# EasyEDA schematic brashmi.json
TITLE: B.R.A.S - HMI & Arduino Mega; REV: 1.1; Date: 13/03/2024; Sheet: 1/1; Company: Lucas kerogs
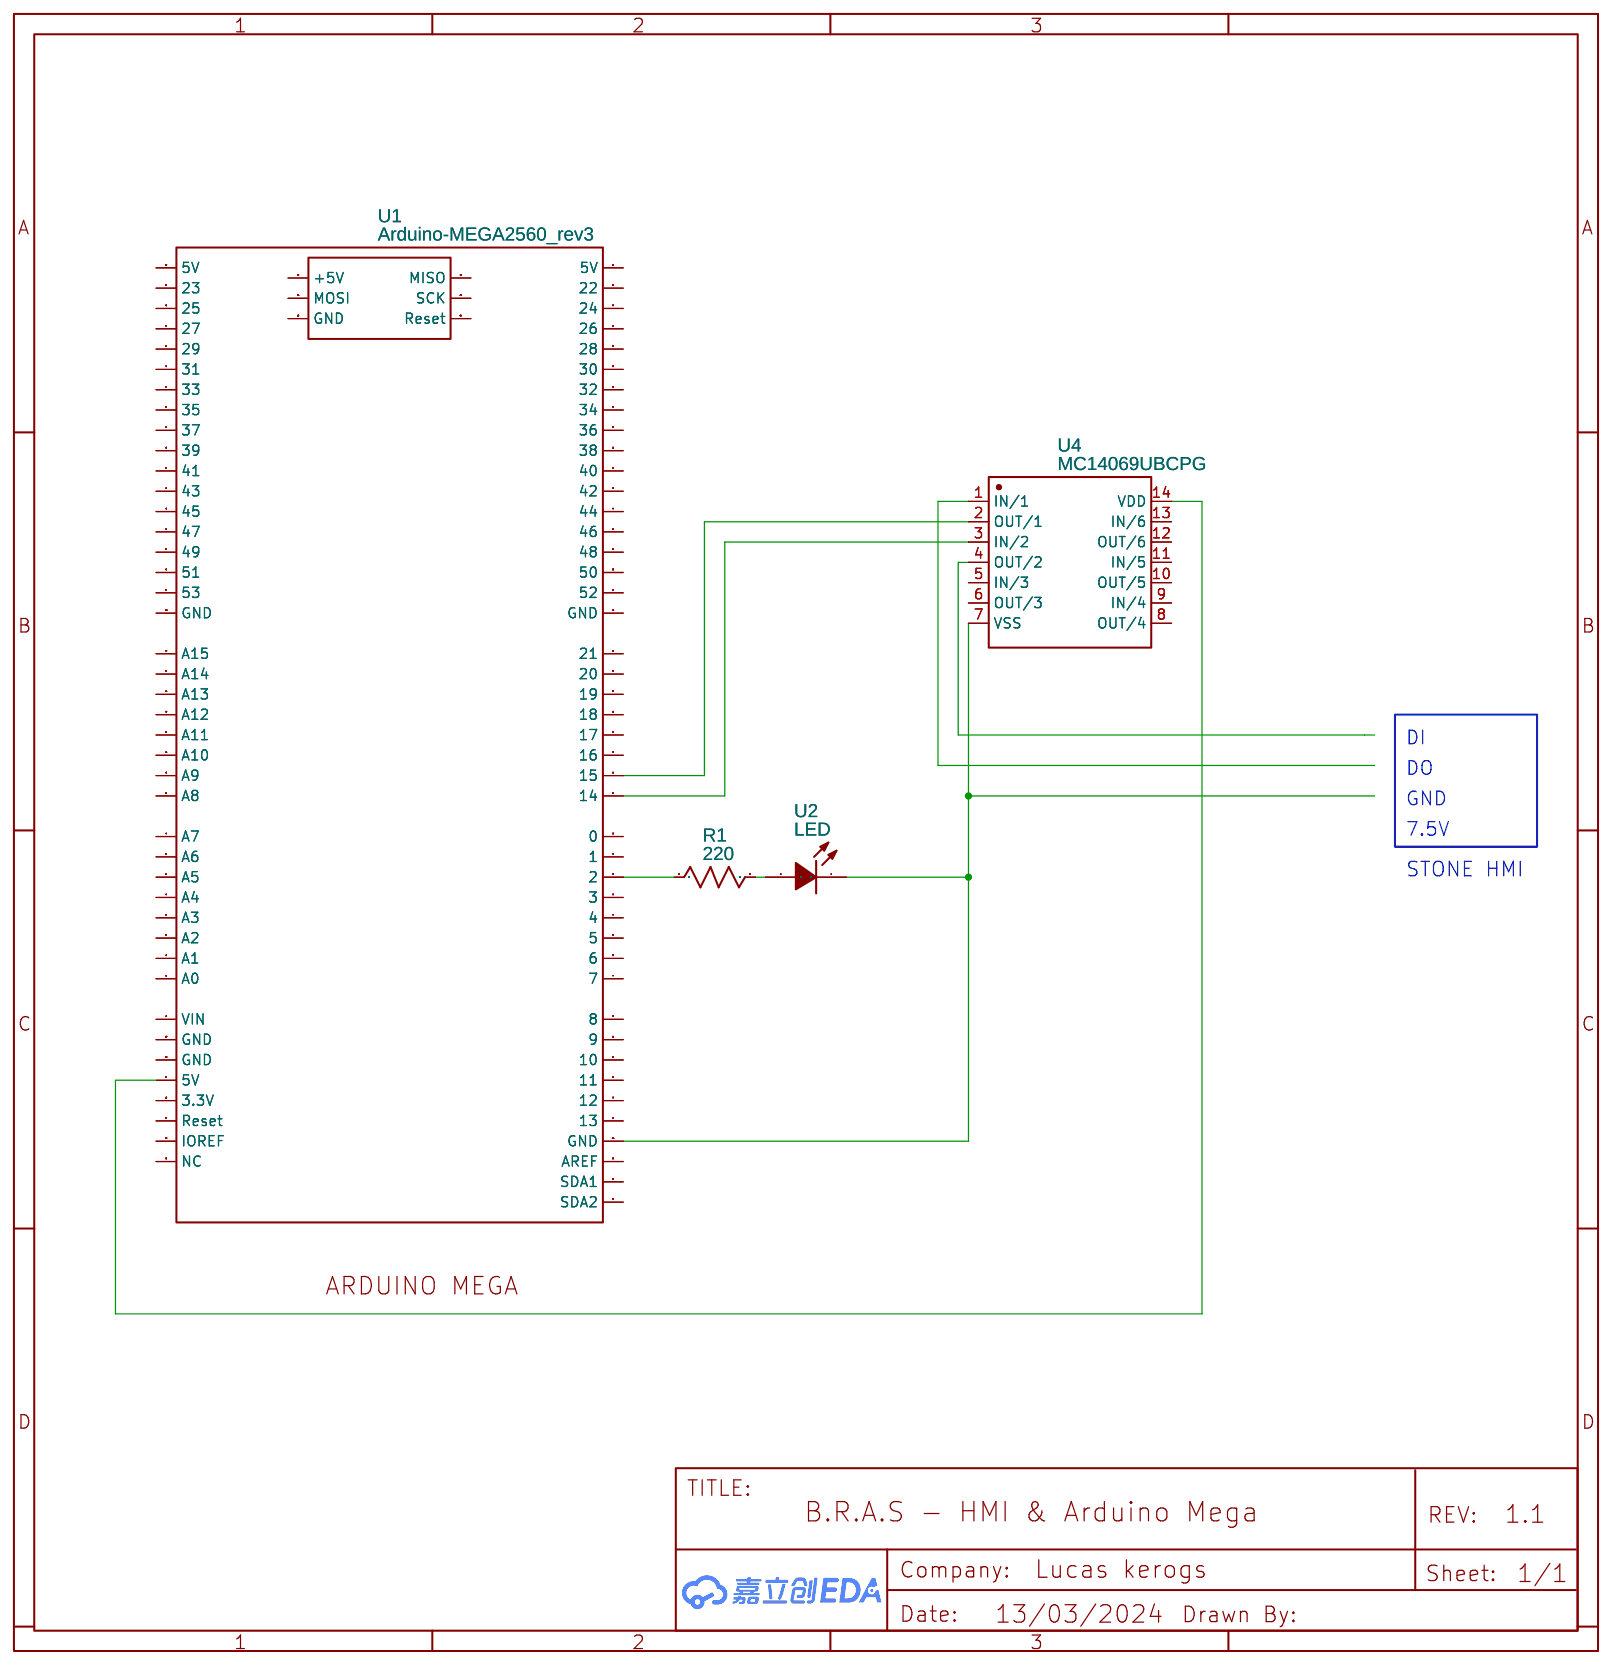
[diagram p0: schematic sheet]

## Parts
R1  220  [R0603]
U1  Arduino-MEGA2560_rev3  [ARDUINO-MEGA2560_REV3-SLOT-FOOTPRINT]
U2  LED  [LED-SMD_SD65-120-LED]
U4  MC14069UBCPG  [DIP14]

## Library data of the parts
R1 = R_0603_US: Contributor: LCEDA_Lib
U1 = Arduino-MEGA2560_rev3: Contributor: macjhon
U2 = 720-LCGH9RNMXNX1: Contributor: lcsc; Supplier: LCSC; Supplier Part: C9900019959; Manufacturer: null; JLCPCB Part Class: Extended Part
U4 = MC14069UBCPG

## Nets
Net-(R1-1): R1.1 U1.2
Net-(R1-2): R1.2 U2.2(A)
Net-(U1-5V): U1.5V U4.14(VDD)
Net-(U1-14): U1.14 U4.3(IN/2)
Net-(U1-15): U1.15 U4.2(OUT/1)
Net-(U1-GND.....): U1.GND.....(GND) U2.1(K) U4.7(VSS)

Not connected (* = marked no-connect by the designer): U1 0 1 3 3.3V 4 5 5V.(5V) 5V..(5V) 6 7 8 9 10 11 12 13 16 17 18 19 20 21 22 23 24 25 26 27 28 29 30 31 32 33 34 35 36 37 38 39 40 41 42 43 44 45 46 47 48 49 50 51 52 53 87(NC) +5V_(+5V) A0 A1 A2 A3 A4 A5 A6 A7 A8 A9 A10 A11 A12 A13 A14 A15 AREF GND.(GND) GND..(GND) GND...(GND) GND....(GND) GND_(GND) IOREF MISO MOSI RESET_(Reset) RST(Reset) SCK SDA1 SDA2 VIN; U4 1(IN/1) 4(OUT/2) 5(IN/3) 6(OUT/3) 8(OUT/4) 9(IN/4) 10(OUT/5) 11(IN/5) 12(OUT/6) 13(IN/6)

## Notes on the sheet
- DI
- DO
- GND
- 7.5V
- STONE HMI
